# Altium project 1kW_BLDC_Controller.PrjPcb (part 1 of 2)
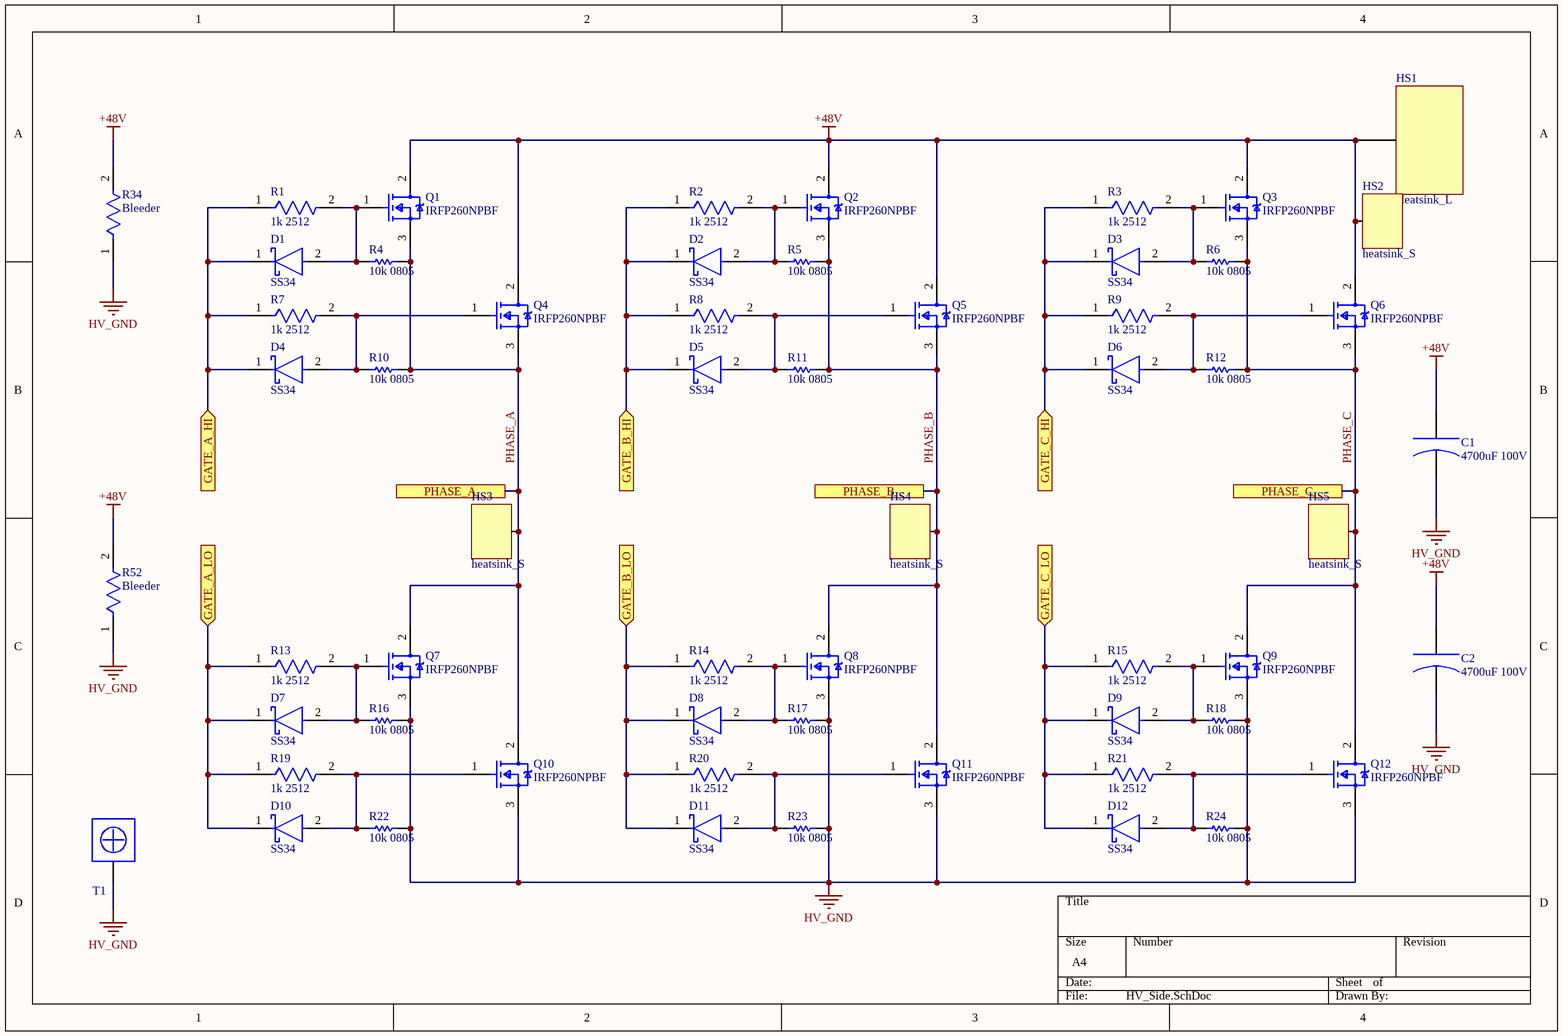
[diagram p0: HV_Side.SchDoc]
8 sheets, 237 parts. Net scope: global (net labels, ports and power ports of the same name join across sheets).
Board files: PCB1.PcbDoc, PCB2.PcbDoc, PCB3.PcbDoc, PCB4.PcbDoc
Sheets:
  HV_Side.SchDoc
  Gate_Driver.SchDoc
  Current_measurement.SchDoc
  Voltage_measurement.SchDoc
  Optocouplers.SchDoc
  optocouplers2.SchDoc
  Precharge circuit.SchDoc
  mcu.SchDoc

## Sheet HV_Side.SchDoc
size A4; SheetNumber: 1; SheetTotal: 8

### Parts
C1  4700uF 100V  [4700uF 100V]
C2  4700uF 100V  [4700uF 100V]
D1  SS34  [DO-214AC]
D2  SS34  [DO-214AC]
D3  SS34  [DO-214AC]
D4  SS34  [DO-214AC]
D5  SS34  [DO-214AC]
D6  SS34  [DO-214AC]
D7  SS34  [DO-214AC]
D8  SS34  [DO-214AC]
D9  SS34  [DO-214AC]
D10  SS34  [DO-214AC]
D11  SS34  [DO-214AC]
D12  SS34  [DO-214AC]
HS1  Heatsink_L  [heatsink_l]
HS2  heatsink_S  [haetsink_s]
HS3  heatsink_S  [haetsink_s]
HS4  heatsink_S  [haetsink_s]
HS5  heatsink_S  [haetsink_s]
Q1  IRFP260NPBF  [FP-PG-TO247-3-MFG]
Q2  IRFP260NPBF  [FP-PG-TO247-3-MFG]
Q3  IRFP260NPBF  [FP-PG-TO247-3-MFG]
Q4  IRFP260NPBF  [FP-PG-TO247-3-MFG]
Q5  IRFP260NPBF  [FP-PG-TO247-3-MFG]
Q6  IRFP260NPBF  [FP-PG-TO247-3-MFG]
Q7  IRFP260NPBF  [FP-PG-TO247-3-MFG]
Q8  IRFP260NPBF  [FP-PG-TO247-3-MFG]
Q9  IRFP260NPBF  [FP-PG-TO247-3-MFG]
Q10  IRFP260NPBF  [FP-PG-TO247-3-MFG]
Q11  IRFP260NPBF  [FP-PG-TO247-3-MFG]
Q12  IRFP260NPBF  [FP-PG-TO247-3-MFG]
R1  1k 2512  [R2512]
R2  1k 2512  [R2512]
R3  1k 2512  [R2512]
R4  10k 0805  [R0805]
R5  10k 0805  [R0805]
R6  10k 0805  [R0805]
R7  1k 2512  [R2512]
R8  1k 2512  [R2512]
R9  1k 2512  [R2512]
R10  10k 0805  [R0805]
R11  10k 0805  [R0805]
R12  10k 0805  [R0805]
R13  1k 2512  [R2512]
R14  1k 2512  [R2512]
R15  1k 2512  [R2512]
R16  10k 0805  [R0805]
R17  10k 0805  [R0805]
R18  10k 0805  [R0805]
R19  1k 2512  [R2512]
R20  1k 2512  [R2512]
R21  1k 2512  [R2512]
R22  10k 0805  [R0805]
R23  10k 0805  [R0805]
R24  10k 0805  [R0805]
R34  Bleeder  [1W Modified THT]
R52  Bleeder  [1W Modified THT]
T1  7701 Keystone Terminal  [7701 Terminal]  (value not drawn)

### Ports
GATE_A_HI (in), GATE_A_LO (in), GATE_B_HI (in), GATE_B_LO (in), GATE_C_HI (in), GATE_C_LO (in), PHASE_A, PHASE_B, PHASE_C

### Nets
+48V: C1.1(+) C2.1(+) HS1.1 HS2.1 Q1.2(D) Q2.2(D) Q3.2(D) Q4.2(D) Q5.2(D) Q6.2(D) R34.2 R52.2
HV_GND: C1.2(GND) C2.2(GND) Q7.3(S) Q8.3(S) Q9.3(S) Q10.3(S) Q11.3(S) Q12.3(S) R16.2 R17.2 R18.2 R22.2 R23.2 R24.2 R34.1 R52.1 T1.1  [project net COM]
H03: D3.1(C) D6.1(C) R3.1 R9.1 ; port GATE_C_HI
HO1: D1.1(C) D4.1(C) R1.1 R7.1 ; port GATE_A_HI
HO2: D2.1(C) D5.1(C) R2.1 R8.1 ; port GATE_B_HI
LO1: D7.1(C) D10.1(C) R13.1 R19.1 ; port GATE_A_LO
LO2: D8.1(C) D11.1(C) R14.1 R20.1 ; port GATE_B_LO
LO3: D9.1(C) D12.1(C) R15.1 R21.1 ; port GATE_C_LO
PHASE_A: HS3.1 Q1.3(S) Q4.3(S) Q7.2(D) Q10.2(D) R4.2 R10.2 ; port PHASE_A
PHASE_B: HS4.1 Q2.3(S) Q5.3(S) Q8.2(D) Q11.2(D) R5.2 R11.2 ; port PHASE_B
PHASE_C: HS5.1 Q3.3(S) Q6.3(S) Q9.2(D) Q12.2(D) R6.2 R12.2 ; port PHASE_C
NetD1_2: D1.2(A) Q1.1(G) R1.2 R4.1
NetD2_2: D2.2(A) Q2.1(G) R2.2 R5.1
NetD3_2: D3.2(A) Q3.1(G) R3.2 R6.1
NetD4_2: D4.2(A) Q4.1(G) R7.2 R10.1
NetD5_2: D5.2(A) Q5.1(G) R8.2 R11.1
NetD6_2: D6.2(A) Q6.1(G) R9.2 R12.1
NetD7_2: D7.2(A) Q7.1(G) R13.2 R16.1
NetD8_2: D8.2(A) Q8.1(G) R14.2 R17.1
NetD9_2: D9.2(A) Q9.1(G) R15.2 R18.1
NetD10_2: D10.2(A) Q10.1(G) R19.2 R22.1
NetD11_2: D11.2(A) Q11.1(G) R20.2 R23.1
NetD12_2: D12.2(A) Q12.1(G) R21.2 R24.1

### Library data of the parts
C1 C2 = 4700uF 100V: 4700uF 100V Electrolytic Capacitor; Price per piece: 185; ComponentLink1Description: Product URL; ComponentLink1URL: https://sharvielectronics.com/product/4700uf-100v-electrolytic-capacitor/; ComponentLink2Description: Datasheet; ComponentLink2URL: *
D1-D12 = SS34: SS34 SMA 40V/3A Schottky Diode SMD Package-DO-214AC; Manufacturer: Vishay Semiconductors; Manufacturer Part Number: SS34-E3/57T; Max Repetitive Reverse Voltage: 40V; Max Junction Temp: +150°C; Forward Current: 3A; Peak Reverse Current: 0.5mA; Max Surge Forward Current: 100A; Standoff Height: 0mm; ComponentLink2Description: Datasheet; Device Class L3: Schottky Diodes; Height: 2.62mm; Lead Free: Yes; Package: 95402; Temperature Range High: +150°C; ComponentLink2URL: http://www.vishay.com/docs/88751/ss32.pdf; Temperature: -55°C to +150°C; Footprint Url: http://www.vishay.com/docs/95402/smc.pdf; Automotive: No; Category: Diode; RoHS: TRUE; Device Class L2: Diodes; Mouser Description: Schottky Diodes & Rectifiers 3.0 Amp 40 Volt; Octopart: https://octopart.com/ss34-e3%2F57t-vishay-39552907; Temperature Range Low: -55°C; Device Class L1: Discrete Semiconductors; Digikey Description: DIODE SCHOTTKY 40V 3A DO214AB; Price per piece: 5.75; Product URL: https://sharvielectronics.com/product/ss34-sma-40v-3a-schottky-diode-smd-package-do-214ac/; Datasheet: https://drive.google.com/file/d/1NCTjjzsUDglehHYd-VxKcrmaXziByLRA/view?usp=sharing
Q1-Q12 = CMP-32901-000262-1: MOSFET N-CH 200V 50A TO247AC; Drain to Source Resistance: 40mR; Turn-On Delay Time: 17ns; Gate to Source Voltage (Vgs): 20V; Turn-Off Delay Time: 55ns; Max Power Dissipation: 300W; Element Configuration: Single; Input Capacitance: 4.057nF; Threshold Voltage: 4V; Width: 0.209inch; Max Operating Temperature: 175°C; Number of Pins: 3; Lead Free: Lead Free; Rds On Max: 40mR; Case/Package: TO-247; Continuous Drain Current (ID): 50A; Power Dissipation: 300W; RoHS Compliant: Yes; Min Operating Temperature: -55°C; Drain to Source Voltage (Vdss): 200V; Mount: Through Hole; REACH SVHC: No SVHC; Packaging: Bulk; Drain to Source Breakdown Voltage: 200V; Halogen Free: Not Halogen Free; Height: 0.799inch; Length: 0.625inch; Max Dual Supply Voltage: 200V; Price per piece: 110.36
  Q4: ComponentLink1Description: Product URL; ComponentLink1URL: https://sharvielectronics.com/product/irfp260npbf-mosfet-200v-50a-n-channel-power-mosfet-to-247-package/; ComponentLink2Description: Datasheet; ComponentLink2URL: https://drive.google.com/file/d/1_dknK1hQ3iHxK7SVbMXCD2-SqB7tXl_1/view?usp=sharing
R1-R3 R7-R9 R13-R15 R19-R21 = 1K_2512: 1K Ohm 1W Resistor 2512 Package; Manufacturer: Vishay Dale; Manufacturer Part Number: CRCW25121R00FKEG; Resistance: 1R; Tolerance: 1%; Voltage Rating: 500V; Temperature Coefficient: 100ppm/°C; Prie per piece: 3.25; Number of Terminations: 2; Packaging: Tape and Reel; Features: Automotive AEC-Q200; Military Standard: Not; Power Rating: 1W; Max Operating Temperature: 155°C; Number of Pins: 2; Radiation Hardening: No; Mount: Surface Mount; Height: 0.6mm; Max Power Dissipation: 1W; Case Code (Metric): 6432; Termination: SMD/SMT; REACH SVHC: No SVHC; Case/Package: 2512; Weight: 0.001429oz; Package Quantity: 2000; Composition: Thick Film; Voltage Rating (DC): 500V; Width: 0.124inch; Length: 6.3mm; Lead Free: Lead Free; Min Operating Temperature: -55°C; Contact Plating: Tin; Case Code (Imperial): 2512; Depth: 3.15mm; Price per piece: 3.25; ComponentLink1Description: Product URL; ComponentLink1URL: https://sharvielectronics.com/product/1k-ohm-1w-resistor-2512-package-pack-of-5/; ComponentLink2Description: Datasheet; ComponentLink2URL: *; Product URL: https://sharvielectronics.com/product/1k-ohm-1w-resistor-2512-package-pack-of-5/; Datasheet: *
R4-R6 R10-R12 R16-R18 R22-R24 = 10k 0805: 10K Ohm 1/8 Watt Resistor 1% Tolerance RC0805FR-0710KL – 0805 Package; Price per piece: 0.82; Product URL: https://sharvielectronics.com/product/10k-ohm-1-8-watt-resistor-1-tolerance-rc0805fr-0710kl-0805-package/; Datasheet: https://drive.google.com/file/d/1pkLQT_RQ1i35oFQcGREpZr7Oy3Ppi-ZT/view?usp=sharing
R34 R52 = 1W Bleeder

## Sheet Gate_Driver.SchDoc
size A4; SheetNumber: 2; SheetTotal: 8; SPICEModelCacheSDNXEFHK: <root> / <DocumentId>SDNXEFHK</DocumentId> / <CacheFrame Number="0"> / <Model Name="jmk325ac6107_m-p" Kind="CKT"> / <Text>* JMK325AC6107_M-P     SPICE MODEL  ( General Type ) / *-------------------------------------------------------------------------------------------------------- / * Model Generated by TAIYO YUDEN Corporation (http://www.ty-top.com) / * Version 1.0 / * TAIYO YUDEN Control No. 180521 / *-------------------------------------------------------------------------------------------------------- / * / * Products Name : Multilayer Ceramic Capacitors / * / * Characteristics : / *     Capacitance : 100 uF , Rated Voltage : 6.3V , TCC : X6S / *     Case Size : 3.2 x 2.5 / 0.126 x 0.098 [mm/inch] , Thickness : 2.5 / 0.098 [mm/inch] / *     (Conditions: Temperature = 25 degC , DC Bias Current/Voltage = 0A / 0V) / * / * Frequency Range : 0.0001MHz - 3000MHz / * / * External Node Assignments : / * / *  1  o---| |---o  2 / * / *-------------------------------------------------------------------------------------------------------- / .SubCkt JMK325AC6107_M-P 1 2 / **************************** / C0 1 110 84.041u / Cm 1 101 6.4542u / C1 101 102 23.925u / Rc1 101 102 26.91 / C2 102 103 22.738u / Rc2 102 103 11.611 / C3 103 110 14.771u / Rc3 103 110 1.1701 / C2m 1 301 2.8348u / C21 301 302 86.426u / Rc21 301 302 122.56 / C22 302 303 42.078u / Rc22 302 303 54.419 / C23 303 304 18.473u / Rc23 303 304 45.467 / C24 304 305 15.24u / Rc24 304 305 25.43 / C25 305 306 12.218u / Rc25 305 306 14.511 / C26 306 307 8.9602u / Rc26 306 307 7.3048 / C27 307 308 6.4396u / Rc27 307 308 4.0856 / C28 308 309 3.5418u / Rc28 308 309 2.2851 / C29 309 110 1.4287u / Rc29 309 110 1.8837 / Rp0 1 110 1Meg / L0 110 120 0.1837n / Lm 120 130 0.44285n / L1 120 121 0.3007n / RL1 121 130 0.18029 / L2 120 122 0.60464n / RL2 122 130 69.963m / L3 120 123 0.74938n / RL3 123 130 2.1757 / CR 120 124 19.095u / LR 124 125 0.53061n / RR 125 130 10.898m / CL 130 140 8.9181p / LL 130 140 0.18335n / RL 130 140 6.5197 / Rs 140 2 1.3136m / **************************** / .ends</Text> / </Model> / </CacheFrame> / </root>
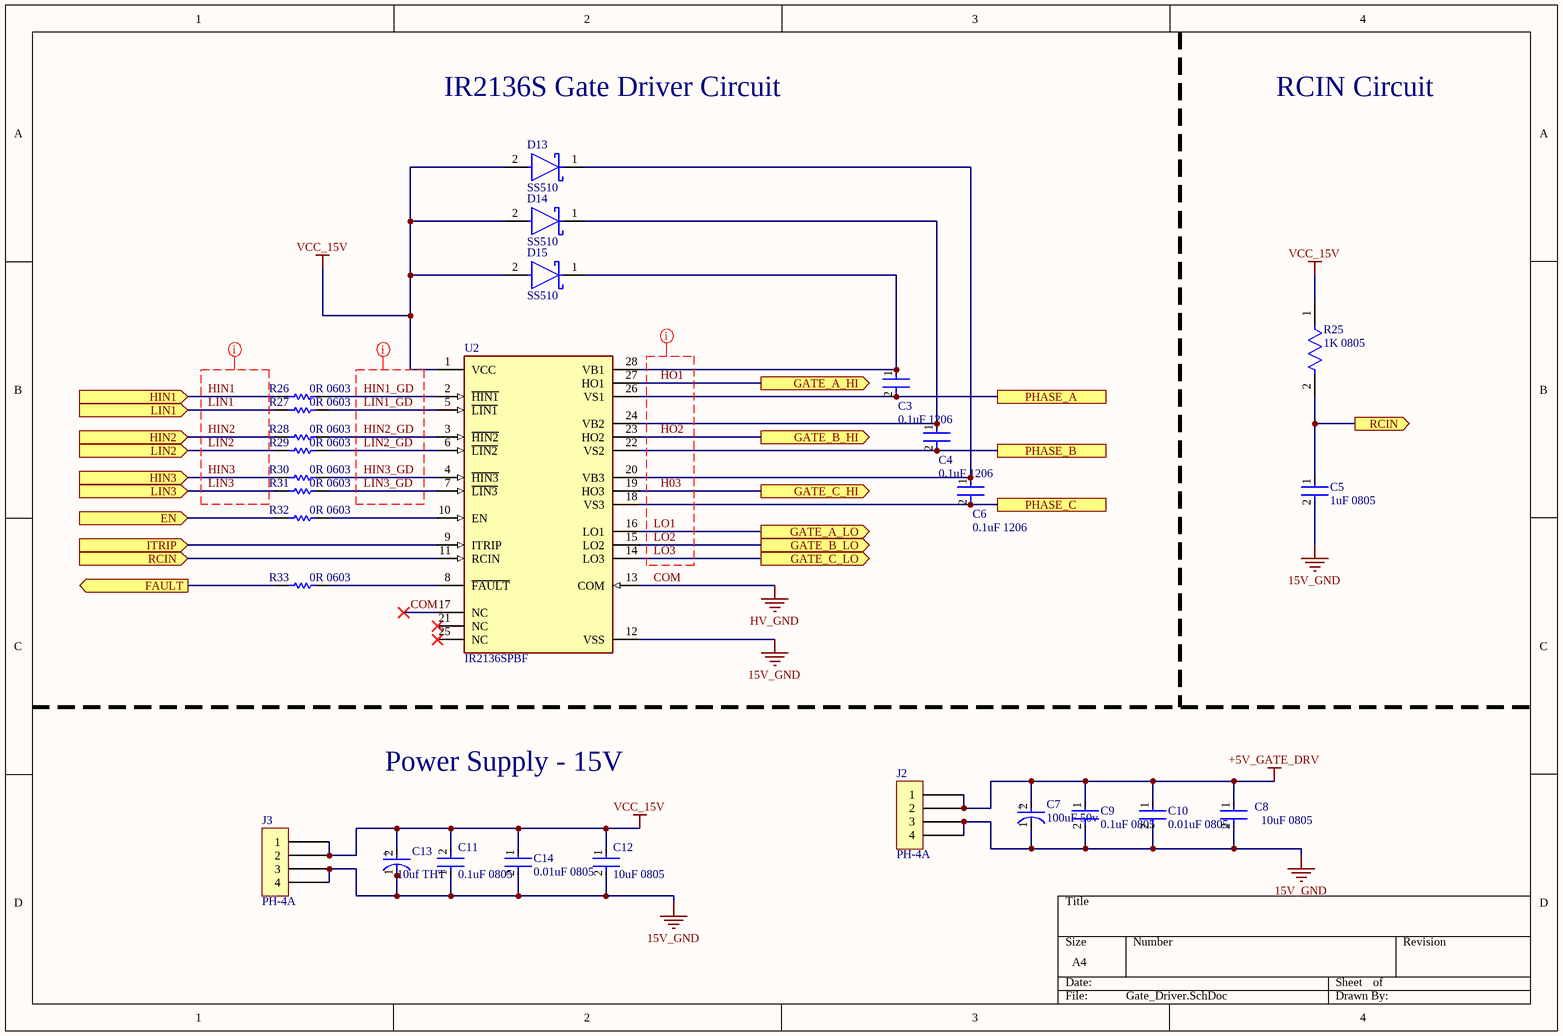
[diagram p1: Gate_Driver.SchDoc]

### Parts
C3  0.1uF 1206  [C1206]
C4  0.1uF 1206  [C1206]
C5  1uF 0805  [R0805]
C6  0.1uF 1206  [C1206]
C7  100uF 50v  [FP-EEU-FR1H101B-MFG]
C8  10uF 0805  [R0805]
C9  0.1uF 0805  [R0805]
C10  0.01uF 0805  [R0805]
C11  0.1uF 0805  [R0805]
C12  10uF 0805  [R0805]
C13  10uf THT  [FP-RAD-TH-D_10_0_5-L_20_2-MFG]
C14  0.01uF 0805  [R0805]
D13  SS510  [DO-210AA]
D14  SS510  [DO-210AA]
D15  SS510  [DO-210AA]
J2  PH-4A  [JST PH-4A]
J3  PH-4A  [JST PH-4A]
R25  1K 0805  [R0805]
R26  0R 0603  [R0603]
R27  0R 0603  [R0603]
R28  0R 0603  [R0603]
R29  0R 0603  [R0603]
R30  0R 0603  [R0603]
R31  0R 0603  [R0603]
R32  0R 0603  [R0603]
R33  0R 0603  [R0603]
U2  IR2136SPBF  [FP-PG-DSO-28-IPC_C]

### Ports
EN (in), FAULT (out), GATE_A_HI (out), GATE_A_LO (out), GATE_B_HI (out), GATE_B_LO (out), GATE_C_HI (out), GATE_C_LO (out), HIN1 (in), HIN2 (in), HIN3 (in), ITRIP (in), LIN1 (in), LIN2 (in), LIN3 (in), PHASE_A, PHASE_B, PHASE_C, RCIN (in), RCIN (out)

### Nets
15V_GND: C5.2 C7.1(C) C8.2 C9.2 C10.2 C11.1 C12.2 C13.1(C) C14.2 J2.3 J2.4 J3.3 J3.4 U2.12(VSS)
+5V_GATE_DRV: C7.2(A) C8.1 C9.1 C10.1 J2.1 J2.2
COM: U2.13(COM) U2.17(NC)  [also labelled HV_GND]
VCC_15V: C11.2 C12.1 C13.2(A) C14.1 D13.2(A) D14.2(A) D15.2(A) J3.1 J3.2 R25.1 U2.1(VCC)
H03: U2.19(HO3) ; port GATE_C_HI
HIN1: R26.1 ; port HIN1
HIN1_GD: R26.2 U2.2(~{HIN1})
HIN2: R28.1 ; port HIN2
HIN2_GD: R28.2 U2.3(~{HIN2})
HIN3: R30.1 ; port HIN3
HIN3_GD: R30.2 U2.4(~{HIN3})
HO1: U2.27(HO1) ; port GATE_A_HI
HO2: U2.23(HO2) ; port GATE_B_HI
LIN1: R27.1 ; port LIN1
LIN1_GD: R27.2 U2.5(~{LIN1})
LIN2: R29.1 ; port LIN2
LIN2_GD: R29.2 U2.6(~{LIN2})
LIN3: R31.1 ; port LIN3
LIN3_GD: R31.2 U2.7(~{LIN3})
LO1: U2.16(LO1) ; port GATE_A_LO
LO2: U2.15(LO2) ; port GATE_B_LO
LO3: U2.14(LO3) ; port GATE_C_LO
PHASE_A: C3.2 U2.26(VS1) ; port PHASE_A
PHASE_B: C4.2 U2.22(VS2) ; port PHASE_B
PHASE_C: C6.2 U2.18(VS3) ; port PHASE_C
NetC3_1: C3.1 D15.1(C) U2.28(VB1)
NetC4_1: C4.1 D14.1(C) U2.24(VB2)
NetC5_1: C5.1 R25.2 U2.11(RCIN) ; port RCIN
NetC6_1: C6.1 D13.1(C) U2.20(VB3)
NetD17_1: R33.1 ; port FAULT
NetQ21_3: U2.9(ITRIP) ; port ITRIP
NetR32_1: R32.1 ; port EN
NetR32_2: R32.2 U2.10(EN)
NetR33_2: R33.2 U2.8(~{FAULT})

Not connected (* = marked no-connect by the designer): U2 21(NC)* 25(NC)*

### Layout directives
net class PWM_IN; rule Matched Net Lengths [Tolerance = 1mm]: HIN1, HIN2, HIN3, LIN1, LIN2, LIN3
net class PWM_GD; rule Matched Net Lengths [Tolerance = 1mm]: HIN1_GD, HIN2_GD, HIN3_GD, LIN1_GD, LIN2_GD, LIN3_GD
net class GATE_DRIVE; rule Matched Net Lengths [Tolerance = 0mm]: H03, HO1, HO2, LO1, LO2, LO3

### Notes on the sheet
- IR2136S Gate Driver Circuit
- RCIN Circuit
- Power Supply - 15V
- (in symbol CMP-05427-000020-1) +
- (in symbol CMP-05427-000384-1) +

### Library data of the parts
C3 C4 C6 = 0.1uF 1206: 0.1uF/100nF 50V Capacitor ±10% Tolerance CC1206KRX7R9BB104 – 1206 Package; Price per piece: 2.22; Product URL: https://sharvielectronics.com/product/0-1uf-100nf-50v-capacitor-%c2%b110-tolerance-cc1206krx7r9bb104-1206-package/; Datasheet: https://sharvielectronics.com/wp-content/uploads/2020/09/Yageo-smd-Capacitor.pdf
C5 = 1uF 0805: 1uF/1000nF 50V Capacitor ±10% Tolerance CC0805KKX7R9BB105 – 0805 Package; Price per piece: 2.16; Product URL: https://sharvielectronics.com/product/1uf-1000nf-50v-capacitor-%c2%b110-tolerance-cc0805kkx7r9bb105-0805-package/; Datasheet: https://drive.google.com/file/d/1wr2K_YaGqgMtACeU2pC6RWLSxDMrIPxr/view?usp=sharing
C7 = CMP-05427-000020-1: 100uF 50V Electrolytic Capacitor – JWCO; Tolerance: 20%; Life (Hours): 6000Hour; Ripple Current: 870mA; Lead Diameter: 0.6mm; Impedance: 61mR; Mount: Through Hole; Lead Free: Lead Free; Length: 11.5mm; Height - Seated (Max): 0.512inch; Contact Plating: Tin; Termination: Radial; Series: FR; Max Operating Temperature: 105°C; Features: General Purpose; Min Operating Temperature: -40°C; RoHS Compliant: Yes; Height: 11.5mm; Voltage Rating (DC): 50V; Diameter: 8mm; Capacitance: 100uF; Lead Pitch: 5mm; Radiation Hardening: No; Package Quantity: 1; Case/Package: Radial; Voltage Rating: 50V; Packaging: Tape and Reel; ESR (Equivalent Series Resistance): 61mR; REACH SVHC: No SVHC; Price per piece: 4.75; Product URL: https://sharvielectronics.com/product/100uf-50v-electrolytic-capacitor-jwco/; Datasheet: https://drive.google.com/file/d/1y5PJPaMvWZ3P4wiieSg8-_Hf04MAZeNc/view?usp=sharing
C8 C12 = 10uF 0805: 10uF/1000nF 50V Capacitor ±10% Tolerance CC0805KKX5R9BB106 – 0805 Package; Product URL: https://sharvielectronics.com/product/10uf-1000nf-50v-capacitor-%c2%b110-tolerance-cc0805kkx5r9bb106-0805-package/; Price per piece: 2.85; Datasheet: https://drive.google.com/file/d/1wr2K_YaGqgMtACeU2pC6RWLSxDMrIPxr/view?usp=sharing
C9 C11 = 0.1uF 0805: 0.1uF/100nF 100V Capacitor ±10% Tolerance CC0805KKX7R0BB104 – 0805 Package; Product URL: https://sharvielectronics.com/product/0-1uf-100nf-100v-capacitor-%c2%b110-tolerance-cc0805kkx7r0bb104-0805-package/; Price per piece: 4.76; Datasheet: https://drive.google.com/file/d/1wr2K_YaGqgMtACeU2pC6RWLSxDMrIPxr/view?usp=sharing
C10 C14 = 0.01uF 0805: 10nF/0.01uF 50V Capacitor ±10% Tolerance 0805B103K500CT – 0805 Package; Product URL: https://sharvielectronics.com/product/10nf-0-01uf-50v-capacitor-%c2%b110-tolerance-0805b103k500ct-0805-package/; Price per piece: 2.45; Datasheet: https://drive.google.com/file/d/18RHnvRuuuVekgJyOA4l8O3UUaSpuKbHR/view?usp=sharing
C13 = CMP-05427-000384-1: Aluminum Electrolytic Capacitors (Radial Lead Type) 10uF ±20% 350V; Lead/Base Style: Straight; Lead Diameter: 0.6mm; Ripple Current (AC): 82mA; Life (Hours): 2000Hour; Series: NHG; Packaging: Bulk; Case/Package: Radial; Contact Plating: Tin; Voltage Rating: 350V; Tolerance: 20%; Termination: Radial; Lead Pitch: 5mm; Max Operating Temperature: 105°C; REACH SVHC: No SVHC; Height - Seated (Max): 0.866inch; Radiation Hardening: No; Voltage Rating (DC): 350V; Diameter: 10mm; Length: 20mm; Mount: Through Hole; Package Quantity: 200; Min Operating Temperature: -25°C; Construction: RADIAL; Ripple Current: 82mA; Height: 20mm; Capacitance: 10uF; RoHS Compliant: Yes; Price per piece: 2.25; Product URL: https://sharvielectronics.com/product/10uf-35v-electrolytic-capacitor-105c-5x11mm-samwha/; Datasheet: https://drive.google.com/file/d/1s8SUY3P6K0bBIcG8WC2zo0Wz7jUZ4bD_/view?usp=sharing
D13-D15 = SS510: SS510-E3/52T – 100V 5A High Voltage Schottky Diode – DO-214AA Package; Product URL: https://sharvielectronics.com/product/ss510-e3-52t-100v-5a-high-voltage-schottky-diode-do-214aa-package/; Datasheet: https://drive.google.com/file/d/1iz5AYn44Er0kaCDKeIane-7fZ44xILG8/view?usp=sharing; Price per piece: 12.75
J2 J3 = 4 Pin JST PH-4A: 4 Pin JST PH-4A Straight Male Connector – 2mm Pitch; Price per piece: 3.55; Product URL: https://sharvielectronics.com/product/4-pin-jst-ph-4a-straight-male-connector-2mm-pitch/; Datasheet: https://drive.google.com/file/d/1xtnH8dmm313gQd5L_EWqAXCnKwT4okMA/view?usp=sharing
R25 = 1k 0805: 1K Ohm 1/8 Watt Resistor 1% Tolerance 0805S8F1001T5E – 0805 Package; Price per piece: 0.82; Product URL: https://sharvielectronics.com/product/1k-ohm-1-8-watt-resistor-1-tolerance-0805s8f1001t5e-0805-package/; Datasheet: https://drive.google.com/file/d/1rtx85iFJaMrDbsv7PAzG9bTFItPmAE38/view?usp=sharing
R26-R33 = R0000 0603: 0 Ohm 1/10 Watt Resistor 1% Tolerance RC0603FR-070RL – 0603 Package; Price per piece: 0.97; Product URL: https://sharvielectronics.com/product/0-ohm-1-10-watt-resistor-1-tolerance-rc0603fr-070rl-0603-package/; Datasheet: https://drive.google.com/file/d/1pkLQT_RQ1i35oFQcGREpZr7Oy3Ppi-ZT/view?usp=sharing
U2 = CMP-32851-000132-1: IC GATE DRVR HALF-BRIDGE 28SOIC; Fall Time: 75ns; Max Supply Voltage: 20V; On-State Resistance: 100R; Output Voltage: 620V; Number of Drivers: 6; Max Output Current: 350mA; Propagation Delay: 425ns; Channel Type: 3-Phase; Min Supply Voltage: 10V; Halogen Free: Halogen Free; Height: 0.093inch; REACH SVHC: No SVHC; RoHS Compliant: Yes; Case/Package: SOIC; Number of Channels: 6; Lead Free: Lead Free; Output Current: 350mA; Number of Outputs: 6; Mount: Surface Mount; Packaging: Rail/Tube; Min Operating Temperature: -40°C; Package Quantity: 25; Series: -; Max Operating Temperature: 150°C; Width: 0.299inch; Length: 0.712inch; Number of Pins: 28; Price per piece: 365; ComponentLink1Description: New link; ComponentLink1URL: *; Product URL: https://sharvielectronics.com/product/ir2136-3-phase-bridge-driver/

## Sheet Current_measurement.SchDoc
size A4; SheetNumber: 3; SheetTotal: 8; SPICEModelCacheJBRCZOZI: <root> / <DocumentId>JBRCZOZI</DocumentId> / <CacheFrame Number="0"> / <Model Name="mcp6001" Kind="CKT"> / <Text>.SUBCKT MCP6001 1 2 3 4 5 / *               | | | | | / *               | | | | Output / *               | | | Negative Supply / *               | | Positive Supply / *               | Inverting Input / *               Non-inverting Input / * / ******************************************************************************** / * Software License Agreement                                                   * / *                                                                              * / * The software supplied herewith by Microchip Technology Incorporated (the     * / * "Company") is intended and supplied to you, the Company's customer, for use  * / * soley and exclusively on Microchip products.                                 * / *                                                                              * / * The software is owned by the Company and/or its supplier, and is protected   * / * under applicable copyright laws. All rights are reserved. Any use in         * / * violation of the foregoing restrictions may subject the user to criminal     * / * sanctions under applicable laws, as well as to civil liability for the       * / * breach of the terms and conditions of this license.                          * / *                                                                              * / * THIS SOFTWARE IS PROVIDED IN AN "AS IS" CONDITION. NO WARRANTIES, WHETHER    * / * EXPRESS, IMPLIED OR STATUTORY, INCLUDING, BUT NOT LIMITED TO, IMPLIED        * / * WARRANTIES OF MERCHANTABILITY AND FITNESS FOR A PARTICULAR PURPOSE APPLY TO  * / * THIS SOFTWARE. THE COMPANY SHALL NOT, IN ANY CIRCUMSTANCES, BE LIABLE FOR    * / * SPECIAL, INCIDENTAL OR CONSEQUENTIAL DAMAGES, FOR ANY REASON WHATSOEVER.     * / ******************************************************************************** / * / * Macromodel for the MCP6001/2/4 op amp family: / *   MCP6001, MCP6001R, MCP6001U, MCP6002, MCP6004 / * / * Revision History: / *   REV A: 21-Jun-02, Created model / *   REV B: 16-Jul-02, Improved output stage / *   REV C: 03-Jan-03, Added MCP6001 / *   REV D: 19-Aug-06, Added over temperature, improved output stage, / *                     fixed overdrive recovery time / *   REV E: 27-Jul-07, Updated output impedance for better model stability w/cap load / *   REV F: 09-Jul-12, Added MCP6001R, MCP6001U / * / * Recommendations: / *   Use PSPICE (other simulators may require translation) / *   For a quick, effective design, use a combination of: data sheet / *     specs, bench testing, and simulations with this macromodel / *   For high impedance circuits, set GMIN=100F in .OPTIONS / * / * Supported: / *   Typical performance for temperature range (-40 to 125) degrees Celsius / *   DC, AC, Transient, and Noise analyses. / *   Most specs, including: offsets, DC PSRR, DC CMRR, input impedance, / *     open loop gain, voltage ranges, supply current, ... , etc. / *   Temperature effects for Ibias, Iquiescent, Iout short circuit / *   current, Vsat on both rails, Slew Rate vs. Temp and P.S. / * / * Not Supported: / *   Some Variation in specs vs. Power Supply Voltage / *   Monte Carlo (Vos, Ib), Process variation / *   Distortion (detailed non-linear behavior) / *   Behavior outside normal operating region / * / * Input Stage / V10  3 10 -500M / R10 10 11 6.90K / R11 10 12 6.90K / C11 11 12 0.2p / C12 1  0 6.00P / E12 71 14 POLY(4) 20 0 21 0 26 0 27 0   1.00M 20.1 20.1 1 1 / G12 1 0 62 0 1m / M12 11 14 15 15 NMI L=2.00U W=42.0U / M14 12  2 15 15 NMI L=2.00U W=42.0U / G14 2 0 62 0 1m / C14  2  0 6.00P / I15 15  4 50.0U / V16 16  4 -300M / GD16 16 1 TABLE {V(16,1)} ((-100,-1p)(0,0)(1m,1n)(2m,1m)(3m,1)) / V13  3 13 -300M / GD13 2 13 TABLE {V(2,13)} ((-100,-1p)(0,0)(1m,1n)(2m,1m)(3m,1)) / R70 1 0 20.6T / R71 2 0 20.6T / R72 1 2 20T / I80 1 2 0.5p / * / * Noise, PSRR, and CMRR / I20 21 20 423U / D20 20  0 DN1 / D21  0 21 DN1 / G26  0 26 POLY(1) 3 4   110U -49U / R26 26  0 1 / G27  0 27 POLY(2) 1 0 2 0   -440U 39.7U 39.7U / R27 27  0 1 / * / * Open Loop Gain, Slew Rate / G30  0 30 POLY(1) 12 11   0 1 / R30 30  0 1K / G31  0 31 POLY(1) 3 4 86 5.25 / R31 31  0 1 TC=2.8m / GD31 30 31 TABLE {V(30,31)} ((-11,-1)(-10,-10n)(0,0)(1m,1000)) / G32 32  0 POLY(1) 3 4 113.7 3.5 / R32 32  0 1 TC=2.65m / GD32 30 32 TABLE {V(30,32)} ((-1m,-1000)(0,0)(10,10n)(11,1)) / G33 0 33 30 0 1m / R33 33 0 1k / G34  0 34 33 0 425M / R34  34 0 1K / C34  34 0 74U / G37  0 37 34 0 1m / R37  37 0 1K / C37  37 0 41.6P / G38  0 38 37 0 1m / R38  39 0 1K / L38  38 39 100U / E38  35 0 38 0 1 / G35 33 0 TABLE {V(35,3)} ((-1,-1n)(0,0)(16,1n))(16.1,1)) / G36 33 0 TABLE {V(35,4)} ((-16.1,-1)((-16,-1n)(0,0)(1,1n)) / * / * Output Stage / R80 50 0 100MEG / G50 0 50 57 96 2 / R58 57  96 0.50 / R57 57  0 750 / C58  5  0 2.00P / G57  0 57 POLY(3) 3 0 4 0 35 0   0 0.67M 0.67M 1.5M / GD55 55 57 TABLE {V(55,57)} ((-2m,-1)(-1m,-1m)(0,0)(10,1n)) / GD56 57 56 TABLE {V(57,56)} ((-2m,-1)(-1m,-1m)(0,0)(10,1n)) / E55 55  0 POLY(2) 3 0 51 0 -0.7m 1 -40.0M / E56 56  0 POLY(2) 4 0 52 0 1.2m 1 -37.0M / R51 51 0 1k / R52 52 0 1k / GD51 50 51 TABLE {V(50,51)} ((-10,-1n)(0,0)(1m,1m)(2m,1)) / GD52 50 52 TABLE {V(50,52)} ((-2m,-1)(-1m,-1m)(0,0)(10,1n)) / G53  3  0 POLY(1) 51 0  -49U 1M / G54  0  4 POLY(1) 52 0  -49U -1M / * / * Current Limit / G99 96 5 99 0 1 / R98 0 98 1 TC=-2.8M,2.63U / G97 0 98 TABLE { V(96,5) } ((-11.0,-10.0M)(-1.00M,-9.9M)(0,0)(1.00M,9.9M)(11.0,10.0M)) / E97 99 0 VALUE { V(98)*((V(3)-V(4))*359M + 310M)} / D98 4 5 DESD / D99 5 3 DESD / * / * Temperature / Voltage Sensitive IQuiscent / R61 0 61 100 TC 3.11M 4.51U / G61 3 4 61 0 1 / G60 0 61 TABLE {V(3, 4)} / + ((0,0)(900M,0.0106U)(1.00,0.20U)(1.3,0.63U) / + (1.5,0.66U)(1.6,1.06U)(5.5,1.10U)) / * / * Temp Sensitive offset voltage / I73 0 70 DC 1uA / R74 0 70 1 TC=2 / E75 1 71 70 0 1 / * / * Temp Sensistive IBias / I62 0 62 DC 1uA / R62 0 62 REXP 58.2u / * Voltage on R62 used for G12, G14 in input stage / * / * Models / .MODEL NMI NMOS / .MODEL DESD  D   N=1 IS=1.00E-15 / .MODEL DL  D   N=1 IS=1F / .MODEL DN1 D   IS=1P KF=146E-18 AF=1 / .MODEL REXP RES TCE=10.1 / .ENDS MCP6001</Text> / </Model> / <Model Name="smk316b7103_f-t" Kind="CKT"> / <Text>* SMK316B7103_F-T     SPICE MODEL  ( General Type ) / *-------------------------------------------------------------------------------------------------------- / * Model Generated by TAIYO YUDEN Corporation (http://www.ty-top.com) / * Version 1.0 / * TAIYO YUDEN Control No. 170508_161201 / * Copyright(c) 2012 TAIYO YUDEN CO.,LTD. All Rights Reserved. / *-------------------------------------------------------------------------------------------------------- / * / * Products Name : Multilayer Ceramic Capacitors / * / * Characteristics : / *     Capacitance : 0.01 uF , Rated Voltage : 630V , TCC : X7R / *     Case Size : 3.2 x 1.6 / 0.126 x 0.063 [mm/inch] , Thickness : 1.15 / 0.045 [mm/inch] / *     (Conditions: Temperature = 25 degC , DC Bias Current/Voltage = 0A / 0V) / * / * Frequency Range : 40Hz - 3GHz / * / * External Node Assignments : / * / *  1  o---| |---o  2 / * / *-------------------------------------------------------------------------------------------------------- / .SubCkt SMK316B7103_F-T 1 2 / **************************** / C0 1 110 9888p / Cm 1 101 398.4p / C1 101 102 1923.4p / Rc1 101 102 288.22k / C2 102 103 1016.2p / Rc2 102 103 14.114k / C3 103 110 4.0985p / Rc3 103 110 430.45 / C2m 1 301 429.64p / C21 301 302 0.05831u / Rc21 301 302 274.72k / C22 302 303 5474.8p / Rc22 302 303 613.52k / C23 303 304 3415.7p / Rc23 303 304 754.71k / C24 304 305 2829.6p / Rc24 304 305 45.094k / C25 305 306 1811.9p / Rc25 305 306 41.061k / C26 306 307 1276.1p / Rc26 306 307 2.7245k / C27 307 308 180.55p / Rc27 307 308 2.1125k / C28 308 309 583.2p / Rc28 308 309 516.69 / C29 309 110 1.724p / Rc29 309 110 368.87 / Rp0 1 110 10G / L0 110 120 0.45307n / Lm 120 130 0.21245n / L1 120 121 3.2969p / RL1 121 130 33.569 / L2 120 122 0.53999n / RL2 122 130 0.49892 / L3 120 123 3.1666n / RL3 123 130 4.2853 / CR 120 124 1050.7p / LR 124 125 0.2527n / RR 125 130 0.40977 / CL 130 140 7.2948p / LL 130 140 0.31535n / RL 130 140 12.803 / Rs 140 2 57.335m / **************************** / .ends SMK316B7103_F-T</Text> / </Model> / <Model Name="qmk325bj104_n-t" Kind="CKT"> / <Text>* QMK325BJ104_N-T     SPICE MODEL  ( General Type ) / *-------------------------------------------------------------------------------------------------------- / * Model Generated by TAIYO YUDEN Corporation (http://www.ty-top.com) / * Version 1.0 / * TAIYO YUDEN Control No. 170508_101215 / * Copyright(c) 2012 TAIYO YUDEN CO.,LTD. All Rights Reserved. / *-------------------------------------------------------------------------------------------------------- / * / * Products Name : Multilayer Ceramic Capacitors / * / * Characteristics : / *     Capacitance : 0.1 uF , Rated Voltage : 250V , TCC : B / X5R / *     Case Size : 3.2 x 2.5 / 0.126 x 0.098 [mm/inch] , Thickness : 1.9 / 0.075 [mm/inch] / *     (Conditions: Temperature = 25 degC , DC Bias Current/Voltage = 0A / 0V) / * / * Frequency Range : 40Hz - 3GHz / * / * External Node Assignments : / * / *  1  o---| |---o  2 / * / *-------------------------------------------------------------------------------------------------------- / .SubCkt QMK325BJ104_N-T 1 2 / **************************** / C0 1 110 0.09559u / Cm 1 101 3751.1p / C1 101 102 0.015822u / Rc1 101 102 51.629k / C2 102 103 7648.8p / Rc2 102 103 3.8642k / C3 103 110 450.5p / Rc3 103 110 113.97 / C2m 1 301 3919.2p / C21 301 302 0.035457u / Rc21 301 302 241.74k / C22 302 303 0.036825u / Rc22 302 303 156.05k / C23 303 304 0.038127u / Rc23 303 304 141.7k / C24 304 305 0.017837u / Rc24 304 305 8.8244k / C25 305 306 0.016301u / Rc25 305 306 9.1046k / C26 306 307 0.010066u / Rc26 306 307 717.43 / C27 307 308 1390.3p / Rc27 307 308 682.39 / C28 308 309 8928.6p / Rc28 308 309 84.912 / C29 309 110 13.208p / Rc29 309 110 119.07 / Rp0 1 110 1G / L0 110 120 0.24814n / Lm 120 130 0.27661n / RL1 120 130 181.88 / L2 120 122 0.76576n / RL2 122 130 0.73015 / L3 120 123 1.0444n / RL3 123 130 1.0157 / CR 120 124 0.022178u / LR 124 125 0.21869n / RR 125 130 0.15853 / CL 130 140 13.866p / LL 130 140 0.20298n / RL 130 140 8.1514 / Rs 140 2 13.921m / **************************** / .ends QMK325BJ104_N-T</Text> / </Model> / <Model Name="ntc_10k_1" Kind="CKT"> / <Text>.SUBCKT NTC_10K_1   1 2   4 5 / ETHERM 1 3 VALUE = { I(VSENSE)*10K*EXP( 3548/(V(4,5)+273) - 3548/(25+273) ) } / VSENSE 3 2 DC 0 / .ENDS</Text> / </Model> / </CacheFrame> / </root>
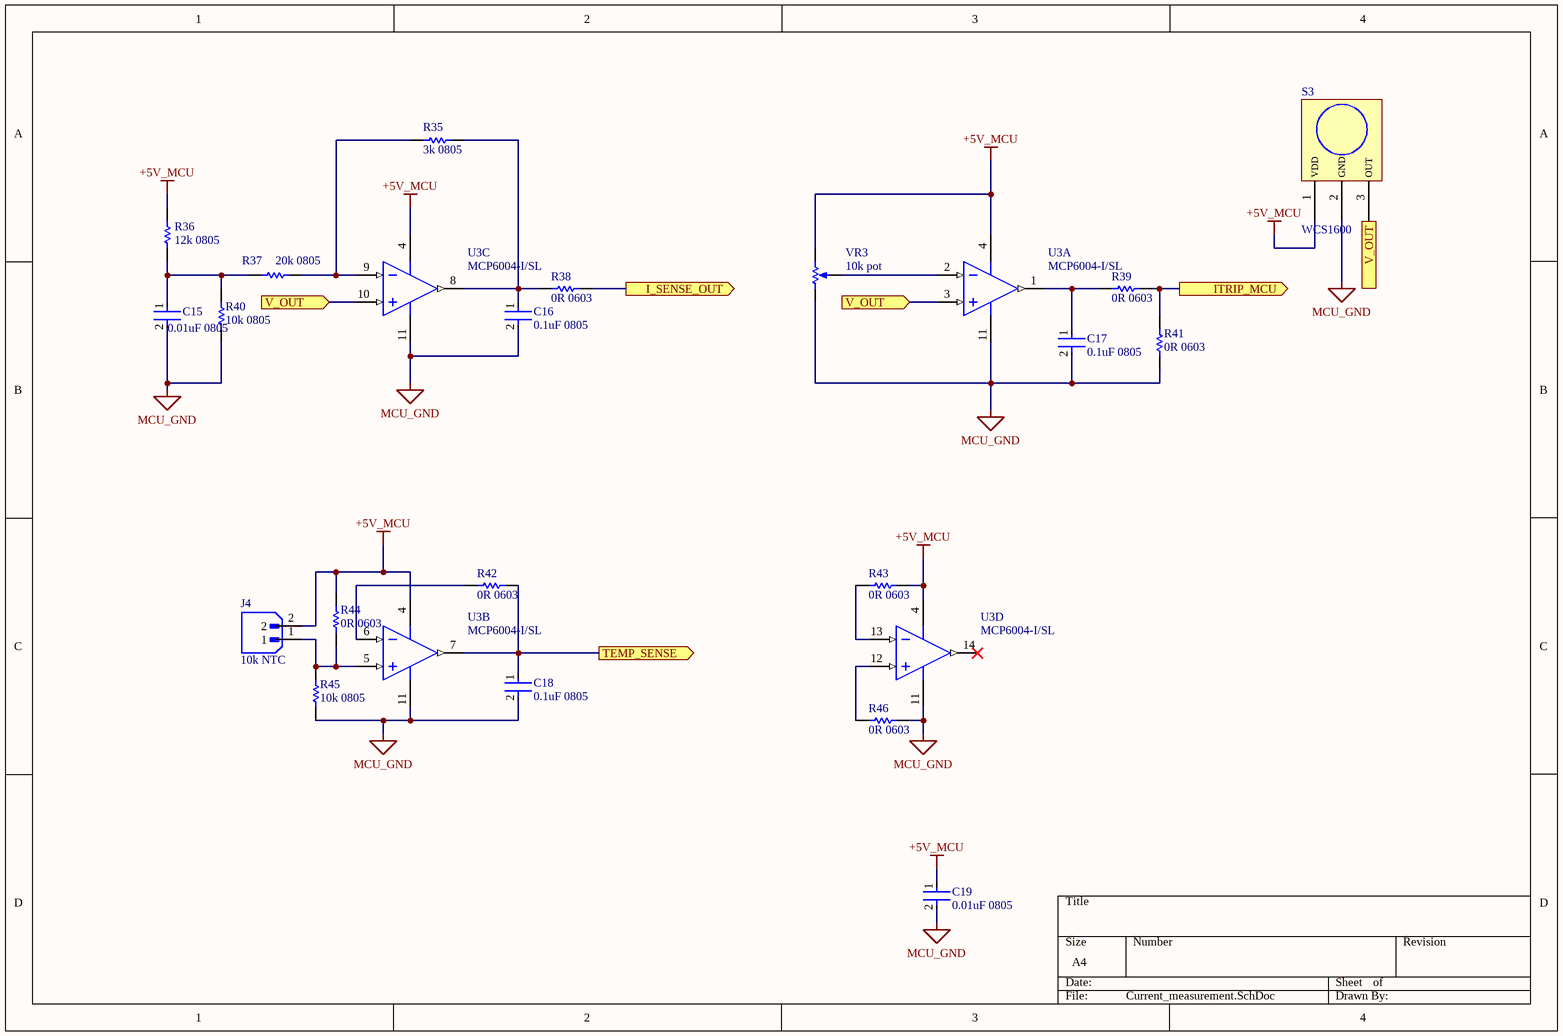
[diagram p2: Current_measurement.SchDoc]

### Parts
C15  0.01uF 0805  [R0805]
C16  0.1uF 0805  [R0805]
C17  0.1uF 0805  [R0805]
C18  0.1uF 0805  [R0805]
C19  0.01uF 0805  [R0805]
J4  10k NTC  [XH2.5-2p]
R35  3k 0805  [R0805]
R36  12k 0805  [R0805]
R37  20k 0805  [R0805]
R38  0R 0603  [R0603]
R39  0R 0603  [R0603]
R40  10k 0805  [R0805]
R41  0R 0603  [R0603]
R42  0R 0603  [R0603]
R43  0R 0603  [R0603]
R44  0R 0603  [R0603]
R45  10k 0805  [R0805]
R46  0R 0603  [R0603]
S3  WCS1600  [2.54mm 4p header]
U3  MCP6004-I/SL  [SOIC-SL14_M]  (parts A,B,C,D of 4)
VR3  10k pot  [BOUR-3299W-3_V]

### Ports
I_SENSE_OUT (out), ITRIP_MCU (out), TEMP_SENSE (out), V_OUT (in), V_OUT (out)

### Nets
+5V_MCU: C19.1 J4.2 R36.2 R43.2 R44.2 S3.1(VDD) U3.4(VDD) VR3.1(CCW)
MCU_GND: C15.2 C16.2 C17.2 C18.2 C19.2 R40.1 R41.1 R45.1 R46.2 S3.2(GND) U3.11(VSS) VR3.3(CW)
NetC15_1: C15.1 R36.1 R37.1 R40.2
NetC16_1: C16.1 R35.2 R38.1 U3.8(VOUTC)
NetC17_1: C17.1 R39.1 U3.1(VOUTA)
NetC18_1: C18.1 R42.2 U3.7(VOUTB) ; port TEMP_SENSE
NetJ4_1: J4.1 R44.1 R45.2 U3.5(VINB+)
NetR35_1: R35.1 R37.2 U3.9(VINC-)
NetR38_2: R38.2 ; port I_SENSE_OUT
NetR39_2: R39.2 R41.2 ; port ITRIP_MCU
NetR42_1: R42.1 U3.6(VINB-)
NetR43_1: R43.1 U3.13(VIND-)
NetR46_1: R46.1 U3.12(VIND+)
NetS3_3: S3.3(OUT) U3.3(VINA+) U3.10(VINC+) ; port V_OUT
NetU3_2: U3.2(VINA-) VR3.2(WIPER)

Not connected (* = marked no-connect by the designer): U3 14(VOUTD)*

### Library data of the parts
C15 C19 = 0.01uF 0805: as C10 on sheet Gate_Driver; Product URL: https://sharvielectronics.com/product/10nf-0-01uf-50v-capacitor-%c2%b110-tolerance-0805b103k500ct-0805-package/; Price per piece: 2.45; Datasheet: https://drive.google.com/file/d/18RHnvRuuuVekgJyOA4l8O3UUaSpuKbHR/view?usp=sharing
C16-C18 = 0.1uF 0805: as C9 on sheet Gate_Driver; Product URL: https://sharvielectronics.com/product/0-1uf-100nf-100v-capacitor-%c2%b110-tolerance-cc0805kkx7r0bb104-0805-package/; Price per piece: 4.76; Datasheet: https://drive.google.com/file/d/1wr2K_YaGqgMtACeU2pC6RWLSxDMrIPxr/view?usp=sharing
J4 = XH2.5-2p: 2 Pin JST-XH Male Straight 2515 Connector 2.54mm Pitch; Price per piece: 1.65; Product URL: https://sharvielectronics.com/product/2-pin-jst-xh-male-straight-2515-connector-2-54mm-pitch/; Datasheet: https://sharvielectronics.com/wp-content/uploads/2021/01/XH-Connector.pdf
R35 = R0805: 3K Ohm 1/8 Watt Resistor 1% Tolerance 0805W8F3001T5E – 0805 Package; Price per piece: 0.82; Product URL: https://sharvielectronics.com/product/3k-ohm-1-8-watt-resistor-1-tolerance-0805w8f3001t5e-0805-package/; Datasheet: https://drive.google.com/file/d/1rtx85iFJaMrDbsv7PAzG9bTFItPmAE38/view?usp=sharing
R36 = R0805: 12K Ohm 1/8 Watt Resistor 1% Tolerance RC0805FR-0712KL – 0805 Package; Price per piece: 0.93; Product URL: https://sharvielectronics.com/product/12k-ohm-1-8-watt-resistor-1-tolerance-rc0805fr-0712kl-0805-package/; Datasheet: https://drive.google.com/file/d/1pkLQT_RQ1i35oFQcGREpZr7Oy3Ppi-ZT/view?usp=sharing
R37 = R0805: 20K ohm 1/8 Watt SMD Resistor 1% Tolerance RC0805FR-0720KL – 0805 Package; Price per piece: 1.15; Product URL: https://sharvielectronics.com/product/20k-ohm-1-8-watt-smd-resistor-1-tolerance-rc0805fr-0720kl-0805-package/; Datasheet: https://drive.google.com/file/d/1pkLQT_RQ1i35oFQcGREpZr7Oy3Ppi-ZT/view?usp=sharing
R38 R39 R41-R44 R46 = R0000 0603: as R26 on sheet Gate_Driver; Price per piece: 0.97; Product URL: https://sharvielectronics.com/product/0-ohm-1-10-watt-resistor-1-tolerance-rc0603fr-070rl-0603-package/; Datasheet: https://drive.google.com/file/d/1pkLQT_RQ1i35oFQcGREpZr7Oy3Ppi-ZT/view?usp=sharing
R40 R45 = 10k 0805: as R4 on sheet HV_Side; Price per piece: 0.82; Product URL: https://sharvielectronics.com/product/10k-ohm-1-8-watt-resistor-1-tolerance-rc0805fr-0710kl-0805-package/; Datasheet: https://drive.google.com/file/d/1pkLQT_RQ1i35oFQcGREpZr7Oy3Ppi-ZT/view?usp=sharing
S3 = WCS1600: WCS1600 100A Hall Effect Linear Current Sensor; Price per piece: 280.67; Product URL: https://sharvielectronics.com/product/wcs1600-100a-hall-effect-linear-current-sensor/; Datasheet: https://sharvielectronics.com/wp-content/uploads/2020/02/WCS1600.pdf
U3 = CMP-0187-00321-3: MCP6004 1MHz Rail-to-Rail Operational Amplifier – SOIC-14 Package; Number of Channels: 4; Amplifier Type: GENERAL PURPOSE; Common Mode Rejection Ratio: 60dB; Voltage Gain: 112dB; Min Supply Voltage: 1.8V; Slew Rate-Nom: 0.6V/µs; Supply Current: 100uA; Input Offset Voltage-Max: 4.5mV; Power Supply Rejection Ratio (PSRR): 86dB; Output Current: 23mA; Operating Supply Voltage: 5.5V; Input Bias Current: 1pA; Max Supply Voltage: 6V; RoHS Compliant: Yes; Technology: CMOS; Radiation Hardening: No; Bandwidth: 1MHz; Number of Elements: 4; REACH SVHC: No SVHC; Number of Amplifiers: 4; Lead Free: Lead Free; Contact Plating: Tin; Max Operating Temperature: 85°C; Packaging: Rail/Tube; Number of Pins: 14; Case/Package: SOIC; Width: 3.9mm; Length: 8.65mm; Unity Gain Bandwidth Product: 1MHz; Gain Bandwidth Product: 1MHz; Input Offset Voltage (Vos): 4.5mV; Package Quantity: 57; Number of Circuits: 4; Min Operating Temperature: -40°C; Nominal Supply Current: 100uA; Height: 1.25mm; Slew Rate: 0.6V/µs; Mount: Surface Mount
VR3 = CMP-2000-05078-1: 10K ohm Variable Resistor-Trimpot 3296 Package; Brand: Bourns; Power Rating: 500mW(1/2W); Unit Weight: 0.035000oz; Qualification: Commercial; Element Type: Cermet; Resistance: 10kOhms; Tolerance: 10%; Temperature Coefficient: 100PPM/C; Voltage Rating: 300V; Adjustment: TopCrossed; Product: Multiturn; Datasheet Version: Sep-04; Datasheet URL: https://datasheet.ciiva.com/19482/769696-19482212.pdf; RoHS: True; Tradename: Trimpot; Product Type: SquareTrimmingPotentiometer; Mounting: PanelMount; Packaging: Tube; Package Reference: 3299W; Operating Temperature Range: -55Cto+125C; Length: 10.03mm; Termination Style: Pin; Manufacturer: Bourns; Manufacturer URL: http://www.bourns.com/; Product Category: TrimmerResistors-ThroughHole; Width: 9.53mm; Taper: Linear; Package Description: 3-Pin Surface Mount Device, Body 9.53 x 6.1 mm, Pitch 2.54 mm; Type: Trimmers; Series: 3299; Product URL: https://sharvielectronics.com/product/10k-ohm-variable-resistor-trimpot-3296-package/; Price per piece: 11.23; Datasheet: https://sharvielectronics.com/wp-content/uploads/2020/06/50K-ohm-Variable-Resistor-Trimpot-3296-Package.pdf

## Sheet Voltage_measurement.SchDoc
size A4; SheetNumber: 4; SheetTotal: 8; SPICEModelCacheGQXFUCOC: <root> / <DocumentId>GQXFUCOC</DocumentId> / </root>
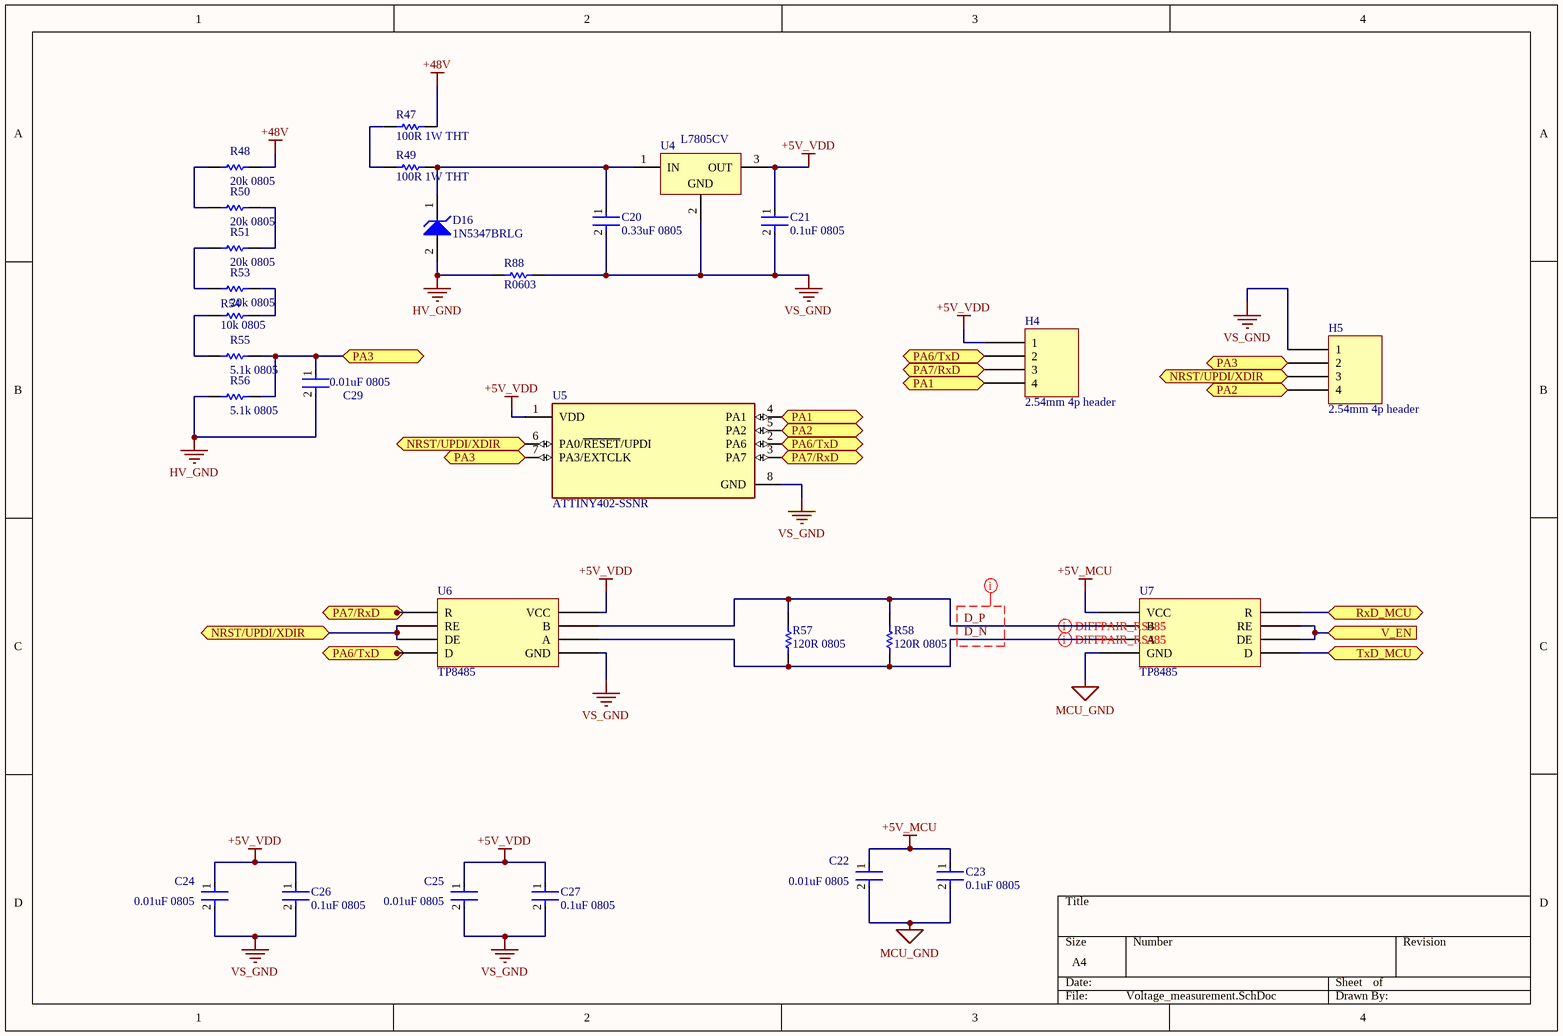
[diagram p3: Voltage_measurement.SchDoc]

### Parts
C20  0.33uF 0805  [R0805]
C21  0.1uF 0805  [R0805]
C22  0.01uF 0805  [R0805]
C23  0.1uF 0805  [R0805]
C24  0.01uF 0805  [R0805]
C25  0.01uF 0805  [R0805]
C26  0.1uF 0805  [R0805]
C27  0.1uF 0805  [R0805]
C29  0.01uF 0805  [R0805]
D16  1N5347BRLG  [ONSC-SURMETIC40-2-017AA-01]
H4  2.54mm 4p header  [2.54mm 4p header]
H5  2.54mm 4p header  [2.54mm 4p header]
R47  100R 1W THT  [1W THT]
R48  20k 0805  [R0805]
R49  100R 1W THT  [1W THT]
R50  20k 0805  [R0805]
R51  20k 0805  [R0805]
R53  20k 0805  [R0805]
R54  10k 0805  [R0805]
R55  5.1k 0805  [R0805]
R56  5.1k 0805  [R0805]
R57  120R 0805  [R0805]
R58  120R 0805  [R0805]
R88  R0603  [R0603]
U4  L7805CV  [TO220]
U5  ATTINY402-SSNR  [FP-C04-057-SWB-IPC_C]
U6  TP8485  [TP8485]
U7  TP8485  [TP8485]

### Ports
NRST/UPDI/XDIR (bidir), PA1 (bidir), PA2 (bidir), PA3 (bidir), PA6/TxD (bidir), PA7/RxD (bidir), RxD_MCU (bidir), TxD_MCU (bidir), V_EN (in)

### Nets
+5V_MCU: C22.1 C23.1 U7.8(VCC)
+5V_VDD: C21.1 C24.1 C25.1 C26.1 C27.1 H4.1 U4.3(OUT) U5.1(VDD) U6.8(VCC)
+48V: R47.1 R48.2
HV_GND: C29.2 D16.2(A) R56.1 R88.1  [project net COM]
MCU_GND: C22.2 C23.2 U7.5(GND)
VS_GND: C20.2 C21.2 C24.2 C25.2 C26.2 C27.2 H5.1 R88.2 U4.2(GND) U5.8(GND) U6.5(GND)
D_N: R57.1 R58.1 U6.6(A) U7.6(A)
D_P: R57.2 R58.2 U6.7(B) U7.7(B)
NetC20_1: C20.1 D16.1(K) R49.1 U4.1(IN)
NetC29_1: C29.1 H5.2 R55.2 R56.2 U5.7(PA3/EXTCLK) ; port PA3
NetH4_2: H4.2 U5.2(PA6) U6.4(D) ; port PA6/TxD
NetH4_3: H4.3 U5.3(PA7) U6.1(R) ; port PA7/RxD
NetH4_4: H4.4 U5.4(PA1) ; port PA1
NetH5_3: H5.3 U5.6(PA0/~{RESET}/UPDI) U6.2(RE) U6.3(DE) ; port NRST/UPDI/XDIR
NetH5_4: H5.4 U5.5(PA2) ; port PA2
NetR47_2: R47.2 R49.2
NetR48_1: R48.1 R50.1
NetR50_2: R50.2 R51.2
NetR51_1: R51.1 R53.1
NetR53_2: R53.2 R54.1
NetR54_2: R54.2 R55.1
NetR124_2: U7.1(R) ; port RxD_MCU
NetU7_2: U7.2(RE) U7.3(DE) ; port V_EN
NetU7_4: U7.4(D) ; port TxD_MCU

### Layout directives
differential pair; differential pair class RS485: D_N, D_P
net class RS485; rule Differential Pairs Routing [Pref Gap = 0.3mm    Min Gap  = 0.3mm    Max Gap  = 0.4mmPref Width = 0.6mm    Min Width  = 0.5mm    Max Width  = 0.6mm]: D_N, D_P

### Library data of the parts
C20 = 0.1uF 0805: 0.33uF/330nF 50V Capacitor ±10% Tolerance CC0805KKX7R9BB334 – 0805 Package; Product URL: https://sharvielectronics.com/product/0-33uf-330nf-50v-capacitor-%C2%B110-tolerance-cc0805kkx7r9bb334-0805-package/; Price per piece: 2.78; Datasheet: https://drive.google.com/file/d/1wr2K_YaGqgMtACeU2pC6RWLSxDMrIPxr/view?usp=sharing
C21 C23 C26 C27 = 0.1uF 0805: as C9 on sheet Gate_Driver; Product URL: https://sharvielectronics.com/product/0-1uf-100nf-100v-capacitor-%c2%b110-tolerance-cc0805kkx7r0bb104-0805-package/; Price per piece: 4.76; Datasheet: https://drive.google.com/file/d/1wr2K_YaGqgMtACeU2pC6RWLSxDMrIPxr/view?usp=sharing
C22 C24 C25 C29 = 0.01uF 0805: as C10 on sheet Gate_Driver; Product URL: https://sharvielectronics.com/product/10nf-0-01uf-50v-capacitor-%c2%b110-tolerance-0805b103k500ct-0805-package/; Price per piece: 2.45; Datasheet: https://drive.google.com/file/d/18RHnvRuuuVekgJyOA4l8O3UUaSpuKbHR/view?usp=sharing
D16 = CMP-1060-01277-1: 5 W Zener Voltage Regulator, 2-Pin Surmetic(TM) 40, Pb-Free, Tape and Reel; Manufacturer: On Semiconductor; VZ Typ (V): 10; P Max (W): 5; Packing: Tape and Reel; PackageReference: SURMETIC40-2-017AA-01; ComponentLink3Description: Package Specification; PartNumber: 1N5347BRLG; ComponentLink3URL: http://www.onsemi.cn/pub_link/Collateral/017AA.PDF; PackageVersion: Rev. O, 09/2005; ComponentLink1URL: http://www.onsemi.com/; DatasheetVersion: Rev. 14; ComponentLink2URL: http://www.onsemi.cn/pub_link/Collateral/1N5333B-D.PDF; RoHS: Pb-Free; ComponentLink1Description: Manufacturer URL; PackageDescription: 2-Pin, Axial Lead, Diameter 3.49 mm; Mounting Technology: Through Hole; ComponentLink2Description: Datasheet; Product URl: https://sharvielectronics.com/product/1n5347b-10v-5-watt-zener-diode-do-35-package/; Price per piece: 16.89; Datasheet: https://drive.google.com/file/d/1Ga-c_Md0AeMcY8wCGBIrhHknR-aAM12m/view?usp=sharing
R47 R49 = 100R 1W THT: 100 Ohm 1 Watt Resistor 5% Tolerance; Price per piece: 2.14; Product URL: https://sharvielectronics.com/product/100-ohm-1-watt-resistor-5-tolerance/
R48 R50 R51 R53 = R0805: as R37 on sheet Current_measurement; Price per piece: 1.15; Product URL: https://sharvielectronics.com/product/20k-ohm-1-8-watt-smd-resistor-1-tolerance-rc0805fr-0720kl-0805-package/; Datasheet: https://drive.google.com/file/d/1pkLQT_RQ1i35oFQcGREpZr7Oy3Ppi-ZT/view?usp=sharing
R54 = 10k 0805: as R4 on sheet HV_Side; Price per piece: 0.82; Product URL: https://sharvielectronics.com/product/10k-ohm-1-8-watt-resistor-1-tolerance-rc0805fr-0710kl-0805-package/; Datasheet: https://drive.google.com/file/d/1pkLQT_RQ1i35oFQcGREpZr7Oy3Ppi-ZT/view?usp=sharing
R55 R56 = R0805: 5.1K Ohm 1/8 Watt Resistor 1% Tolerance 0805S8F5101T5E – 0805 Package; Price per piece: 1.92; Product URL: https://sharvielectronics.com/product/5-1k-ohm-1-8-watt-resistor-1-tolerance-0805s8f5101t5e-0805-package/; Datasheet: https://drive.google.com/file/d/1rtx85iFJaMrDbsv7PAzG9bTFItPmAE38/view?usp=sharing
R57 R58 = R0805: 120 Ohm 1/8 Watt Resistor 1% Tolerance RC0805FR-07120RL – 0805 Package; Variant: 62 Ohm 1/8 Watt Resistor 1% Tolerance RC0805FR-0762RL – 0805 Package; Price per piece: 0.86; Product URL: https://sharvielectronics.com/product/120-ohm-1-8-watt-resistor-1-tolerance-rc0805fr-07120rl-0805-package/; Datasheet: https://drive.google.com/file/d/1pkLQT_RQ1i35oFQcGREpZr7Oy3Ppi-ZT/view?usp=sharing
U4 = CMP-0244-00483-1: Positive Voltage Regulator, 5V, 3-Pin TO-220; PackageDescription: TO, Thru-Hole, Vertical, Heatsink Mounted; 3 In-Line Leads; Pitch 2.54 mm; ComponentLink2Description: Datasheet; PackageReference: TO220; ComponentLink3URL: http://www.st.com/internet/com/TECHNICAL_RESOURCES/TECHNICAL_LITERATURE/PACKAGE_INFORMATION/CD00004649.pdf; DatasheetVersion: 16/11/2011; ComponentLink1Description: Manufacturer URL; ComponentLink1URL: http://www.st.com; PackageVersion: ver3.0; ComponentLink3Description: Package Specification; ComponentLink2URL: http://www.st.com/internet/com/TECHNICAL_RESOURCES/TECHNICAL_LITERATURE/DATASHEET/CD00000444.pdf
U5 = CMP-06276-000139-1: IC MCU 8BIT 4KB FLASH 8SOIC; Core Architecture: AVR; Interface: I2C; Frequency: 20MHz; Oscillator Type: Internal; Peripherals: Brown-out Detect/Reset; Number of I/Os: 6; Memory Size: 4KB; Min Operating Temperature: -40°C; Memory Type: FLASH; Case/Package: SOIC; Packaging: Tape and Reel; Max Operating Temperature: 105°C; Number of Pins: 8; RoHS Compliant: Yes
U6 U7 = TP8485: TP8485E – RS485 Transceiver Interface IC SOIC-8 Package; Product URL: https://sharvielectronics.com/product/tp8485e-rs485-transceiver-interface-ic-soic-8-package/; Price per piece: 28.94; Datasheet: https://drive.google.com/file/d/1U_aS4Uf2IPB18ZIqPadQc-TMP5dizR4y/view?usp=sharing
H4 H5 = 2.54mm 4p header: Price per piece: *; Product URL: *; Datasheet: *
R88 = R0603: Price per Piece: *; Product URL: *; Datasheet: *

## Sheet Optocouplers.SchDoc
size A4; SheetNumber: 5; SheetTotal: 8
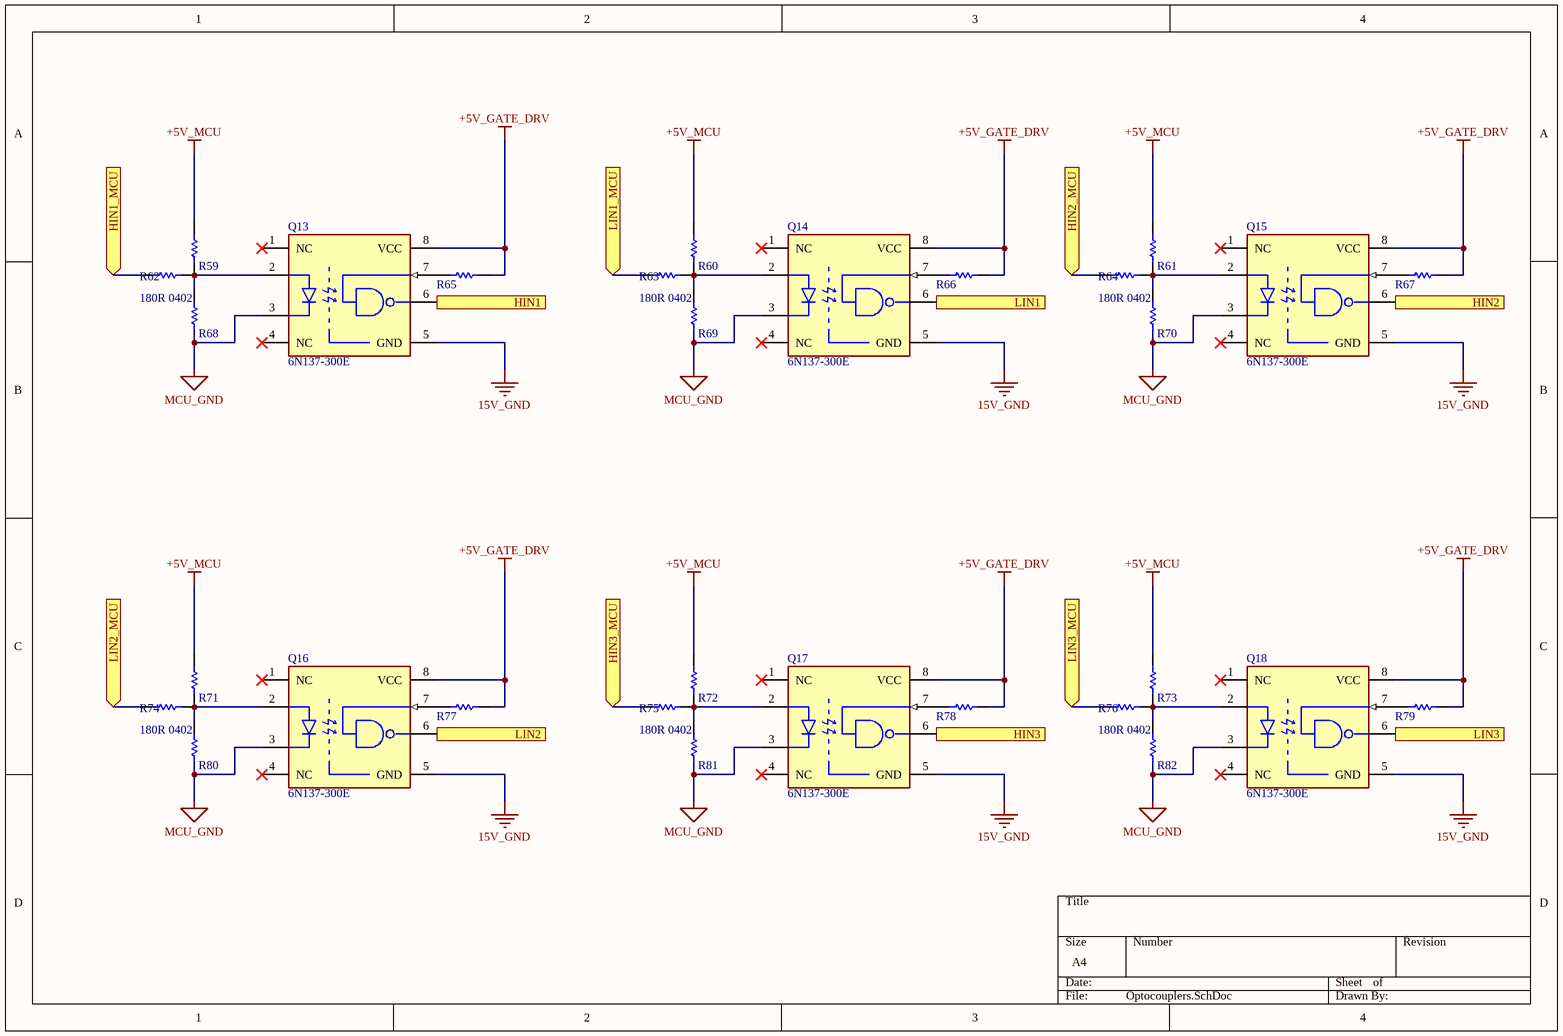
[diagram p4: Optocouplers.SchDoc]

### Parts
Q13  6N137-300E  [FP-6N137-300E-MFG]
Q14  6N137-300E  [FP-6N137-300E-MFG]
Q15  6N137-300E  [FP-6N137-300E-MFG]
Q16  6N137-300E  [FP-6N137-300E-MFG]
Q17  6N137-300E  [FP-6N137-300E-MFG]
Q18  6N137-300E  [FP-6N137-300E-MFG]
R59  0R 0603  [R0603]  (value not drawn)
R60  0R 0603  [R0603]  (value not drawn)
R61  0R 0603  [R0603]  (value not drawn)
R62  180R 0402  [R08050402]
R63  180R 0402  [R08050402]
R64  180R 0402  [R08050402]
R65  0R 0603  [R0603]  (value not drawn)
R66  0R 0603  [R0603]  (value not drawn)
R67  0R 0603  [R0603]  (value not drawn)
R68  0R 0603  [R0603]  (value not drawn)
R69  0R 0603  [R0603]  (value not drawn)
R70  0R 0603  [R0603]  (value not drawn)
R71  0R 0603  [R0603]  (value not drawn)
R72  0R 0603  [R0603]  (value not drawn)
R73  0R 0603  [R0603]  (value not drawn)
R74  180R 0402  [R08050402]
R75  180R 0402  [R08050402]
R76  180R 0402  [R08050402]
R77  0R 0603  [R0603]  (value not drawn)
R78  0R 0603  [R0603]  (value not drawn)
R79  0R 0603  [R0603]  (value not drawn)
R80  0R 0603  [R0603]  (value not drawn)
R81  0R 0603  [R0603]  (value not drawn)
R82  0R 0603  [R0603]  (value not drawn)

### Ports
HIN1 (out), HIN1_MCU (in), HIN2 (out), HIN2_MCU (in), HIN3 (out), HIN3_MCU (in), LIN1 (out), LIN1_MCU (in), LIN2 (out), LIN2_MCU (in), LIN3 (out), LIN3_MCU (in)

### Nets
15V_GND: Q13.5(GND) Q14.5(GND) Q15.5(GND) Q16.5(GND) Q17.5(GND) Q18.5(GND)
+5V_GATE_DRV: Q13.8(VCC) Q14.8(VCC) Q15.8(VCC) Q16.8(VCC) Q17.8(VCC) Q18.8(VCC) R65.2 R66.2 R67.2 R77.2 R78.2 R79.2
+5V_MCU: R59.2 R60.2 R61.2 R71.2 R72.2 R73.2
MCU_GND: Q13.3(C) Q14.3(C) Q15.3(C) Q16.3(C) Q17.3(C) Q18.3(C) R68.1 R69.1 R70.1 R80.1 R81.1 R82.1
HIN1: Q13.6(VO) ; port HIN1
HIN1_MCU: R62.1 ; port HIN1_MCU
HIN2: Q15.6(VO) ; port HIN2
HIN2_MCU: R64.1 ; port HIN2_MCU
HIN3: Q17.6(VO) ; port HIN3
HIN3_MCU: R75.1 ; port HIN3_MCU
LIN1: Q14.6(VO) ; port LIN1
LIN1_MCU: R63.1 ; port LIN1_MCU
LIN2: Q16.6(VO) ; port LIN2
LIN2_MCU: R74.1 ; port LIN2_MCU
LIN3: Q18.6(VO) ; port LIN3
LIN3_MCU: R76.1 ; port LIN3_MCU
NetQ13_2: Q13.2(A) R59.1 R62.2 R68.2
NetQ13_7: Q13.7(VE) R65.1
NetQ14_2: Q14.2(A) R60.1 R63.2 R69.2
NetQ14_7: Q14.7(VE) R66.1
NetQ15_2: Q15.2(A) R61.1 R64.2 R70.2
NetQ15_7: Q15.7(VE) R67.1
NetQ16_2: Q16.2(A) R71.1 R74.2 R80.2
NetQ16_7: Q16.7(VE) R77.1
NetQ17_2: Q17.2(A) R72.1 R75.2 R81.2
NetQ17_7: Q17.7(VE) R78.1
NetQ18_2: Q18.2(A) R73.1 R76.2 R82.2
NetQ18_7: Q18.7(VE) R79.1

Not connected (* = marked no-connect by the designer): Q13 1(NC)* 4(NC)*; Q14 1(NC)* 4(NC)*; Q15 1(NC)* 4(NC)*; Q16 1(NC)* 4(NC)*; Q17 1(NC)* 4(NC)*; Q18 1(NC)* 4(NC)*

### Library data of the parts
Q13-Q18 = CMP-18400-000015-1: 6N137 – High-Speed Optocoupler-SOP8; Manufacturer: Broadcom; Min Supply Voltage: 4.5V; Forward Voltage: 1.5V; Turn Off Delay Time: 50ns; Standoff Height: 0.505mm; Reverse Voltage: 5V; Isolation Voltage: 3750Vrms; Forward Current: 10mA; Turn On Delay Time: 48ns; Max Supply Voltage: 5.5V; Package: 0; Automotive: No; Lead Free: Yes; ComponentLink2Description: Datasheet; Temperature: -40°C to +85°C; Device Class L3: unset; Height: 4.455mm; Ambient Temperature Range Low: -40°C; Digikey Description: OPTOISO 3.75KV OPN COLL 8DIP GW; Temperature Range Low: -40°C; ComponentLink2URL: https://docs.broadcom.com/docs/AV02-0940EN; Mouser Description: High Speed Optocouplers 10 Mb/s 3750Vrms; Category: Trans; Ambient Temperature Range High: +85°C; RoHS: TRUE; Octopart: https://octopart.com/6n137-300e-broadcom-71125550; Manufacturer Part Number: 6N137-300E; Device Class L1: Optoelectronics; Device Class L2: Optocouplers; Temperature Range High: +85°C; Price per piece: 36; Product URL: https://sharvielectronics.com/product/6n137-high-speed-optocoupler-sop8/; Datasheet: https://sharvielectronics.com/wp-content/uploads/2020/11/6n137.pdf
  Q14-Q18: Parameter 1: *
R59-R61 R65-R73 R77-R82 = R0000 0603: as R26 on sheet Gate_Driver; Price per piece: 0.97; Product URL: https://sharvielectronics.com/product/0-ohm-1-10-watt-resistor-1-tolerance-rc0603fr-070rl-0603-package/; Datasheet: https://drive.google.com/file/d/1pkLQT_RQ1i35oFQcGREpZr7Oy3Ppi-ZT/view?usp=sharing
R62-R64 R74-R76 = R0805-0402: 180 Ohm 1/4 Watt Resistor – 0402 Package; Price per piece: 0.85; Product URL: https://sharvielectronics.com/product/180-ohm-1-4-watt-resistor-0402-package-pack-of-20/; Datasheet: https://sharvielectronics.com/wp-content/uploads/2020/09/smd_Resistor_0603_0805_1206.pdf